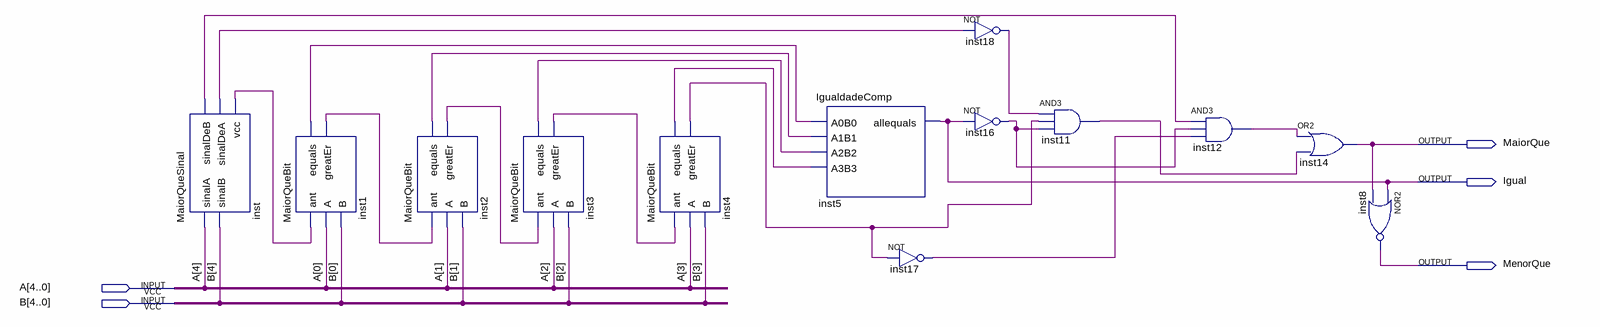
[diagram p0: schematic sheet]
// Quartus schematic Comparador.bdf as structural Verilog: 13 symbols, 5 pins
module Comparador (
  input  [4:0] A,
  input  [4:0] B,
  output MaiorQue,
  output Igual,
  output MenorQue
);

  wire inst1_equals, inst1_greater, inst2_equals, inst2_greater, inst3_equals, inst3_greater, inst4_equals,
       inst4_greater, inst11_out, inst12_out, inst16_out, inst17_out, inst18_out, inst_sinaldea,
       inst_sinaldeb, inst_vcc;

  MaiorQueSinal inst (.sinalA(A[4]), .sinalB(B[4]), .sinalDeB(inst_sinaldeb), .sinalDeA(inst_sinaldea), .vcc(inst_vcc));
  MaiorQueBit inst1 (.ant(inst_vcc), .A(A[0]), .B(B[0]), .equals(inst1_equals), .greatEr(inst1_greater));
  MaiorQueBit inst2 (.ant(inst1_greater), .A(A[1]), .B(B[1]), .equals(inst2_equals), .greatEr(inst2_greater));
  MaiorQueBit inst3 (.ant(inst2_greater), .A(A[2]), .B(B[2]), .equals(inst3_equals), .greatEr(inst3_greater));
  MaiorQueBit inst4 (.ant(inst3_greater), .A(A[3]), .B(B[3]), .equals(inst4_equals), .greatEr(inst4_greater));
  IgualdadeComp inst5 (
    .A0B0(inst1_equals), .A1B1(inst2_equals), .A2B2(inst3_equals), .A3B3(inst4_equals), .allequals(Igual));
  not inst17 (inst17_out, inst4_greater);
  not inst18 (inst18_out, inst_sinaldea);
  not inst16 (inst16_out, Igual);
  and inst11 (inst11_out, inst18_out, inst4_greater, inst16_out);
  and inst12 (inst12_out, inst_sinaldeb, inst16_out, inst17_out);
  or inst14 (MaiorQue, inst12_out, inst11_out);
  nor inst8 (MenorQue, Igual, MaiorQue);
endmodule
